# Altium schematic sheet Active_Clamp.SchDoc
size A4; SheetNumber: 5; SheetTotal: 6
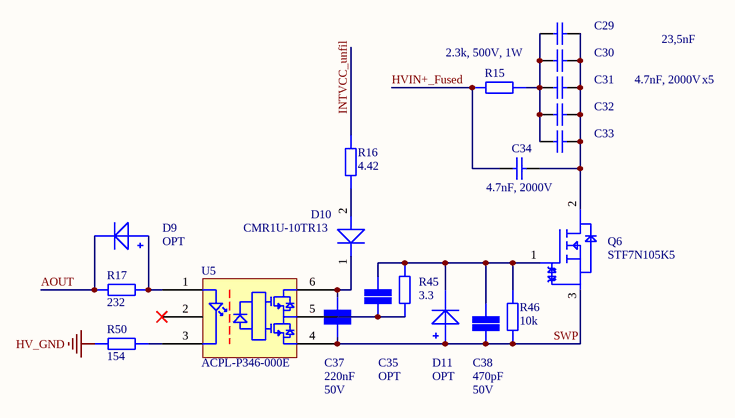
[diagram p0: Active_Clamp.SchDoc]

## Parts
C29  4.7nF, 2000V  [WCAP-CSMH_1812_H2]
C30  4.7nF, 2000V  [WCAP-CSMH_1812_H2]  (value not drawn)
C31  4.7nF, 2000V  [WCAP-CSMH_1812_H2]  (value not drawn)
C32  4.7nF, 2000V  [WCAP-CSMH_1812_H2]  (value not drawn)
C33  4.7nF, 2000V  [WCAP-CSMH_1812_H2]  (value not drawn)
C34  4.7nF, 2000V  [WCAP-CSMH_1812_H2]
C35  value OPT  [CAP 1206/3216]  (hidden comment: SMD Capacitor)
C37  value 220nF  Voltage: 50V  [CAP 1206/3216]  (hidden comment: SMD Capacitor)
C38  value 470pF  Voltage: 50V  [CAP 1206/3216]  (hidden comment: SMD Capacitor)
D9  OPT  [DIOM2715X18N]
D10  CMR1U-10TR13  [DIOC4536X24L CMR1U-10]
D11  OPT  [DIOM2715X18N]
Q6  STF7N105K5  [TO-220-3]
R15  value 2.3k, 500V, 1W  [STACKPOLE CSRN2512]  (hidden comment: CRCW25122K20FKEG)
R16  value 4.42  [STACKPOLE CSR0603]  (hidden comment: SMD Resistor)
R17  value 232  [STACKPOLE CSR1206]  (hidden comment: SMD Resistor)
R45  value 3.3  [STACKPOLE CSR0603]  (hidden comment: SMD Resistor)
R46  value 10k  [STACKPOLE CSR0603]  (hidden comment: SMD Resistor)
R50  value 154  [STACKPOLE CSR1206]  (hidden comment: SMD Resistor)
U5  ACPL-P346-000E  [SOP-6 Stretched]

## Nets
HV_GND: R50.1
AOUT: D9.2 R17.1
HVIN+_Fused: C34.1 R15.2
INTVCC_unfil: R16.2
SWP: C37.2 C38.2 D11.1 Q6.3 R46.1 U5.4
NetC29_1: C29.1 C30.1 C31.1 C32.1 C33.1 R15.1
NetC29_2: C29.2 C30.2 C31.2 C32.2 C33.2 C34.2 Q6.2
NetC35_1: C35.1 C38.1 D11.2 Q6.1 R45.2 R46.2
NetC35_2: C35.2 R45.1 U5.5
NetC37_1: C37.1 D10.1 U5.6
NetD9_1: D9.1 R17.2 U5.1
NetD10_2: D10.2 R16.1
NetR50_2: R50.2 U5.3

Not connected (* = marked no-connect by the designer): U5 2*

## Notes on the sheet
- 23,5nF
- x5

## Library data of the parts
C29-C34 = 885342211008: WCAP-CSMH Multilayer Ceramic Chip Capacitor, size 1812, X7R Class II, 4.7nF, 2000V; Manufacturer: Wurth Elektronik; Rated Voltage: 2000VDC; Insulation Resistance: 10GOhm; Dissipation Factor: 2.5%; Capacitance Tolerance: +/-10%; Technical Reference: X7R1812472KB00DFCT10000; ComponentLink1Description: Manufacturer; ComponentLink1URL: http://www.we-online.de; ComponentLink2Description: Datasheet; ComponentLink2URL: https://www.we-online.com/catalog/datasheet/885342211008.pdf; Manufacturer Part Number: 885342211008; Mounting Technology: SMT; Operating Temperature: -55 to +125degC; Published Date: May 2020; Packaging: Tape and Reel; Ceramic Type: X7R Class II; Capacitance: 4.7nF; Height: 2mm; Size: 1812
  C33 C34: Voltage: 2000V
C35 C37 C38 = SMD Capacitor: Capacitor with multiple Footprints
D9 D11 = BAT46WH: Supplier 1: Mouser
D10 = CMR1U-10TR13: Silicon Ultra Fast Recovery Rectifier 1000V 30A 2-Pin SMB Surface Mount T/R; Manufacturer: Central Semiconductor; Average Rectified Current: 1A; Reverse Recovery Time: 100ns; Max Reverse Voltage (DC): 1kV; Forward Voltage: 1.7V; Max Reverse Current: 5uA; Supplier 1: Digi-Key; Manufacturer Part Number: CMR1U-10TR13; RoHS: No; Category: Rectifier Diodes; Pricing 1: 1=1,16000, 10=1,03800, 100=0,80960, 500=0,66880, 1000=0,52800 (USD); Mount: Surface Mount; Case/Package: SMB; Packaging: Tape and Reel; Max Repetitive Reverse Voltage (Vrrm): 1kV; RoHS Compliant: No; Lead Free: Lead Free; ComponentLink1URL: http://www.mouser.com/ds/2/68/cmr1u-01-34700.pdf?src-supplier=Mouser; ComponentLink1Description: http://www.mouser.com/ds/2/68/cmr1u-01-34700.pdf?src-supplier=Mouser; ComponentLink2URL: https://www.centralsemi.com/get_document.php?cmp=1&mergetype=pd&mergepath=pd&pdf_id=CMR1U-01.PDF&src-supplier=Digi-Key; ComponentLink2Description: https://www.centralsemi.com/get_document.php?cmp=1&mergetype=pd&mergepath=pd&pdf_id=CMR1U-01.PDF&src-supplier=Digi-Key; ComponentLink3URL: http://www.centralsemi.com/pdf/CMR1U-01.PDF?src-supplier=Future+Electronics; ComponentLink3Description: http://www.centralsemi.com/pdf/CMR1U-01.PDF?src-supplier=Future+Electronics; ComponentLink4URL: https://my.centralsemi.com/get_document.php?cmp=1&amp;mergetype=pd&amp;mergepath=pd&amp;pdf_id=CMR1U-01.PDF&src-supplier=Digi-Key; ComponentLink4Description: https://my.centralsemi.com/get_document.php?cmp=1&amp;mergetype=pd&amp;mergepath=pd&amp;pdf_id=CMR1U-01.PDF&src-supplier=Digi-Key
Q6 = STF7N105K5: N-channel 1050 V, 1.4 Ohm typ., 4 A MDmesh K5 Power MOSFETs in TO-220FP package; Manufacturer: STMicroelectronics; Drain to Source Voltage (Vdss): 1.05kV; Continuous Drain Current (ID): 4A; Rds On Max: 2R; Input Capacitance: 380pF; Max Power Dissipation: 25W; Supplier 1: Newark; Manufacturer Part Number: STF7N105K5; RoHS: Yes; Category: MOSFETs; Stock 1: 996; Pricing 1: 1=3,16000, 10=2,71000, 100=2,16000, 500=1,87000, 1000=1,61000 (USD); Mount: Through Hole; Case/Package: TO-220-3; Min Operating Temperature: -55°C; Max Operating Temperature: 150°C; Packaging: Rail/Tube; Lead Free: Lead Free; RoHS Compliant: Yes; ComponentLink1URL: http://www.mouser.com/ds/2/389/stf7n105k5-955843.pdf?src-supplier=Mouser; ComponentLink1Description: http://www.mouser.com/ds/2/389/stf7n105k5-955843.pdf?src-supplier=Mouser; ComponentLink2URL: http://www.st.com/content/ccc/resource/technical/document/datasheet/26/20/d1/f7/b4/c1/4c/55/DM00112886.pdf/files/DM00112886.pdf/jcr:content/translations/en.DM00112886.pdf?src-supplier=Digi-Key; ComponentLink2Description: http://www.st.com/content/ccc/resource/technical/document/datasheet/26/20/d1/f7/b4/c1/4c/55/DM00112886.pdf/files/DM00112886.pdf/jcr:content/translations/en.DM00112886.pdf?src-supplier=Digi-Key; ComponentLink3URL: http://www.st.com/st-web-ui/static/active/en/resource/technical/document/datasheet/DM00112886.pdf?src-supplier=Avnet; ComponentLink3Description: http://www.st.com/st-web-ui/static/active/en/resource/technical/document/datasheet/DM00112886.pdf?src-supplier=Avnet; ComponentLink4URL: http://www.farnell.com/datasheets/2371890.pdf?src-supplier=Newark; ComponentLink4Description: http://www.farnell.com/datasheets/2371890.pdf?src-supplier=Newark
R15-R17 R45 R46 R50 = SMD Resistor: Resistor with multiple footprints
U5 = ACPL-P346-000E: Logic IC Output Optocoupler, 1-Element, 3750V Isolation; Manufacturer: Broadcom Avago; Propagation Delay: 120ns; Number of Channels: 1; Forward Voltage: 1.55V; Max Output Current: 2.5A; Pulse Width Distortion (PWD): 50ns; High Level Output Current: 2A; Operating Supply Voltage: 20V; Forward Current: 4mA; Max Power Dissipation: 550mW; Rise Time: 8ns; Isolation Voltage: 3.75kV; Output Current: 1A; Input Current: 11mA; Max Input Current: 25mA; Approvals: CSA,UR,UL,IEC; Supplier 1: Digi-Key; Manufacturer Part Number: ACPL-P346-000E; RoHS: Yes; Category: Optocouplers; Stock 1: 1063; Pricing 1: 1=5,00000, 10=3,53300, 100=2,89340, 500=2,43922, 1000=2,38050 (USD); Mount: Surface Mount; Case/Package: SOIC; Number of Pins: 6; Min Operating Temperature: -40°C; Max Operating Temperature: 105°C; Packaging: Rail/Tube; Package Quantity: 100; Turn-On Delay Time: 120ns; Low Level Output Current: 2A; Fall Time: 8ns; Output Voltage: 20V; Radiation Hardening: No; RoHS Compliant: Yes; REACH SVHC: No SVHC